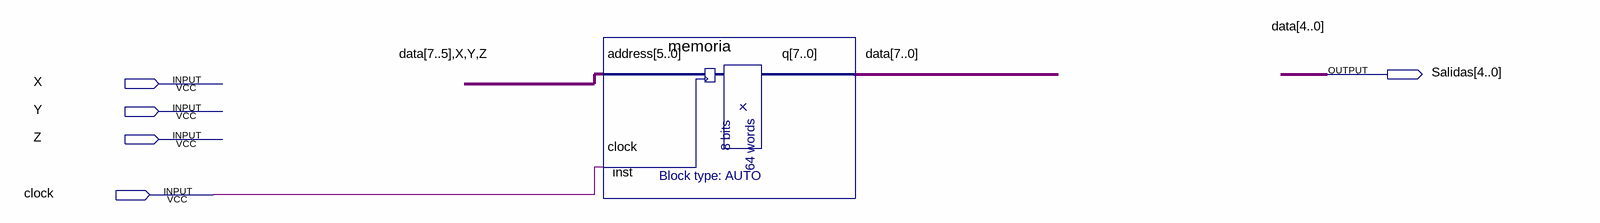
[diagram p0: schematic sheet]
// Quartus schematic tres.bdf as structural Verilog: 1 symbols, 5 pins
module tres (
  input  X,
  input  Y,
  input  Z,
  input  clock,
  output [4:0] Salidas
);

  wire [7:5] data;

  memoria inst (.address({data, X, Y, Z}), .clock(clock), .q({data, Salidas}));

  // Other names for the same wires on the sheet: data[4:0] = Salidas
endmodule
